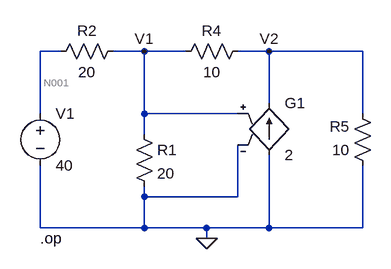
[diagram p0: schematic dependent_source_3.asc]
dependent_source_3.asc, the LTspice schematic file:
Version 4
SHEET 1 880 680
WIRE -48 32 -80 32
WIRE 80 32 32 32
WIRE 144 32 80 32
WIRE 272 32 224 32
WIRE 416 32 272 32
WIRE 272 112 272 32
WIRE -80 128 -80 32
WIRE 80 128 80 32
WIRE 224 128 80 128
WIRE 416 128 416 32
WIRE 80 160 80 128
WIRE 80 256 80 240
WIRE 224 256 224 176
WIRE 224 256 80 256
WIRE -80 304 -80 208
WIRE 80 304 80 256
WIRE 80 304 -80 304
WIRE 176 304 80 304
WIRE 272 304 272 192
WIRE 272 304 176 304
WIRE 416 304 416 208
WIRE 416 304 272 304
WIRE 176 320 176 304
FLAG 176 320 0
FLAG 80 32 V1
FLAG 272 32 V2
SYMBOL res 64 144 R0
SYMATTR InstName R1
SYMATTR Value 20
SYMBOL res -64 48 R270
WINDOW 0 32 56 VTop 2
WINDOW 3 0 56 VBottom 2
SYMATTR InstName R2
SYMATTR Value 20
SYMBOL res 128 48 R270
WINDOW 0 32 56 VTop 2
WINDOW 3 0 56 VBottom 2
SYMATTR InstName R4
SYMATTR Value 10
SYMBOL res 432 224 R180
WINDOW 0 36 76 Left 2
WINDOW 3 36 40 Left 2
SYMATTR InstName R5
SYMATTR Value 10
SYMBOL voltage -80 112 R0
SYMATTR InstName V1
SYMATTR Value 40
SYMBOL g 272 96 R0
SYMATTR InstName G1
SYMATTR Value 2
TEXT -80 320 Left 2 !.op

The netlist it stands for:
* dependent_source_3.asc
R1 V1 0 20
R2 N001 V1 20
R4 V1 V2 10
R5 0 V2 10
V1 N001 0 40
G1 0 V2 V1 0 2
.op
.backanno
.end

* Results of the author's LTspice run, read from the files saved beside the schematic
* Operating Point:
*   V(v1) = -2.353 V
*   V(n001) = 40 V
*   V(v2) = -24.71 V
*   I(R5) = 2.471 A
*   I(R4) = 2.235 A
*   I(R2) = 2.118 A
*   I(R1) = -117.6 mA
*   I(G1) = -4.706 A
*   I(V1) = -2.118 A